# Altium schematic sheet 7-LTC2983.SchDoc: Thermocouple Temperature Logger
size A4; Date: 14.03.2026; Author: MG & JK; Revision: 1-0; SheetNumber: 7; SheetTotal: 7; Model: Rev 1.0; PageSetup: Record=PageOptions|CenterHorizontal=True|CenterVertical=True|PrintScale=0.52|XCorrection=1.00|YCorrection=1.00|PrintKind=1|BorderSize=5000000|LeftOffset=0|BottomOffset=0|Orientation=2|PaperLength=4200|PaperWidth=2970|Scale=100|PaperSource=7|PrintQuality=600|MediaType=1|DitherType=10|PaperKind=A3|PrintScaleMode=1
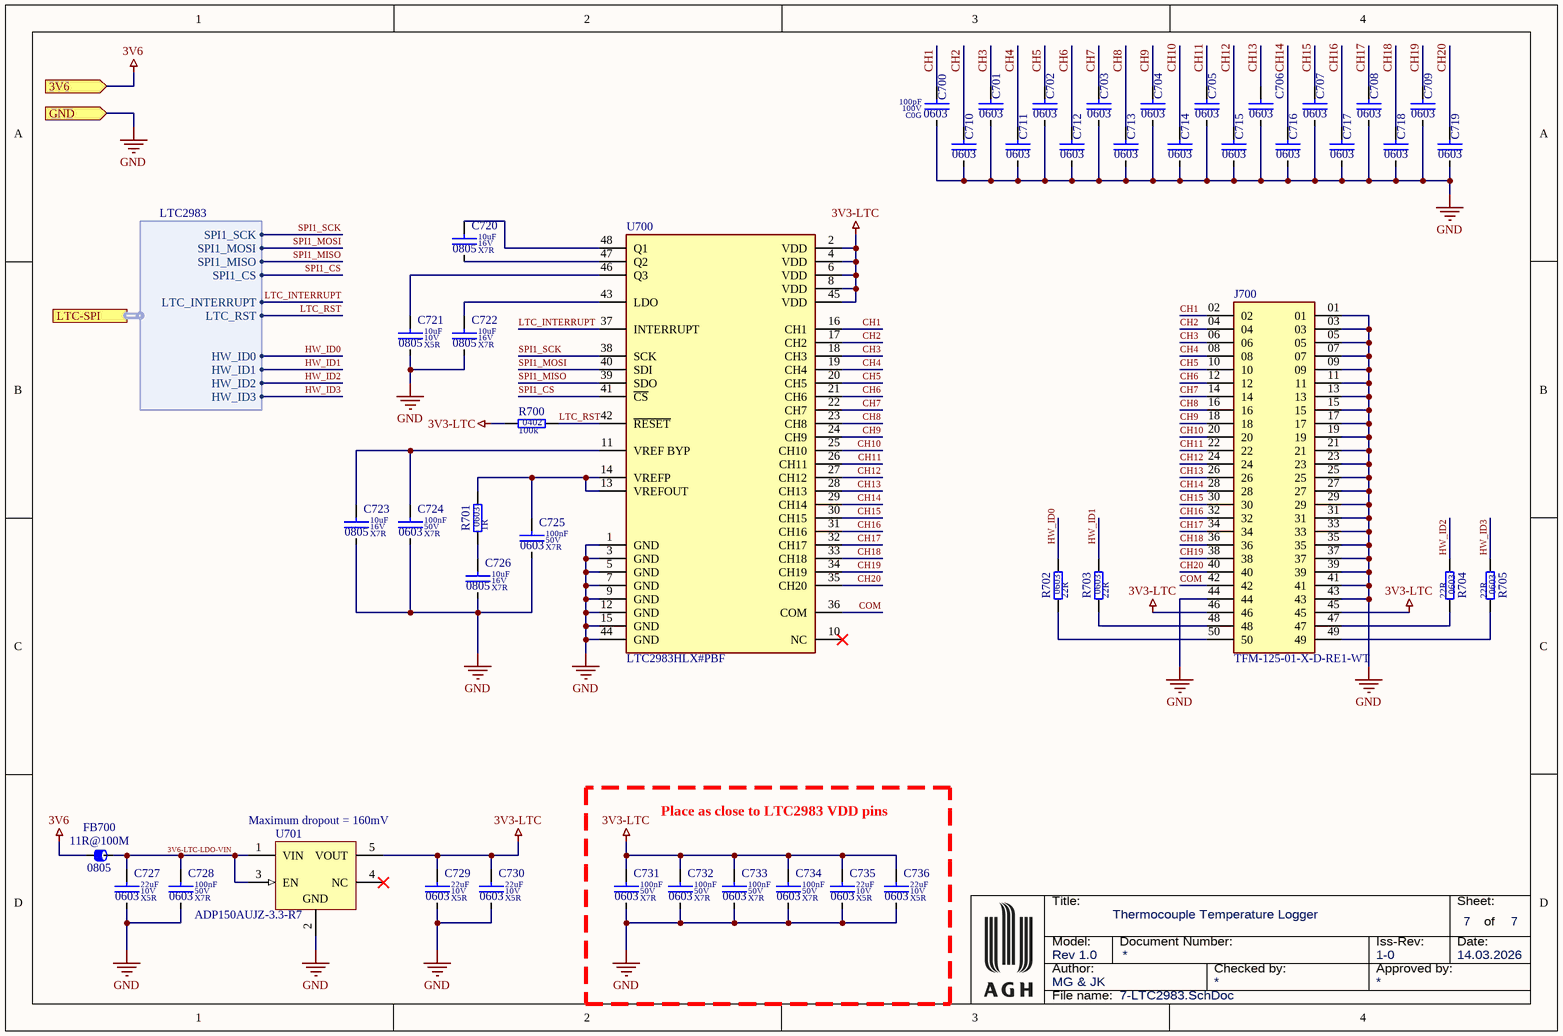
[diagram p0: 7-LTC2983.SchDoc]

## Parts
C700  value 100pF  Dielectric: C0G  Voltage: 100V  SCH_Footprint: 0603  [C_0603_1608]  (hidden comment: Ceramic C0G)
C701  SCH_Footprint: 0603  [C_0603_1608]  (hidden comment: Ceramic C0G)
C702  SCH_Footprint: 0603  [C_0603_1608]  (hidden comment: Ceramic C0G)
C703  SCH_Footprint: 0603  [C_0603_1608]  (hidden comment: Ceramic C0G)
C704  SCH_Footprint: 0603  [C_0603_1608]  (hidden comment: Ceramic C0G)
C705  SCH_Footprint: 0603  [C_0603_1608]  (hidden comment: Ceramic C0G)
C706  SCH_Footprint: 0603  [C_0603_1608]  (hidden comment: Ceramic C0G)
C707  SCH_Footprint: 0603  [C_0603_1608]  (hidden comment: Ceramic C0G)
C708  SCH_Footprint: 0603  [C_0603_1608]  (hidden comment: Ceramic C0G)
C709  SCH_Footprint: 0603  [C_0603_1608]  (hidden comment: Ceramic C0G)
C710  SCH_Footprint: 0603  [C_0603_1608]  (hidden comment: Ceramic C0G)
C711  SCH_Footprint: 0603  [C_0603_1608]  (hidden comment: Ceramic C0G)
C712  SCH_Footprint: 0603  [C_0603_1608]  (hidden comment: Ceramic C0G)
C713  SCH_Footprint: 0603  [C_0603_1608]  (hidden comment: Ceramic C0G)
C714  SCH_Footprint: 0603  [C_0603_1608]  (hidden comment: Ceramic C0G)
C715  SCH_Footprint: 0603  [C_0603_1608]  (hidden comment: Ceramic C0G)
C716  SCH_Footprint: 0603  [C_0603_1608]  (hidden comment: Ceramic C0G)
C717  SCH_Footprint: 0603  [C_0603_1608]  (hidden comment: Ceramic C0G)
C718  SCH_Footprint: 0603  [C_0603_1608]  (hidden comment: Ceramic C0G)
C719  SCH_Footprint: 0603  [C_0603_1608]  (hidden comment: Ceramic C0G)
C720  value 10uF  Dielectric: X7R  Voltage: 16V  SCH_Footprint: 0805  [C_0805_2012]  (hidden comment: Ceramic X7R)
C721  value 10uF  Dielectric: X5R  Voltage: 10V  SCH_Footprint: 0805  [C_0805_2012]  (hidden comment: Ceramic X5R)
C722  value 10uF  Dielectric: X7R  Voltage: 16V  SCH_Footprint: 0805  [C_0805_2012]  (hidden comment: Ceramic X7R)
C723  value 10uF  Dielectric: X7R  Voltage: 16V  SCH_Footprint: 0805  [C_0805_2012]  (hidden comment: Ceramic X7R)
C724  value 100nF  Dielectric: X7R  Voltage: 50V  SCH_Footprint: 0603  [C_0603_1608]  (hidden comment: Ceramic X7R)
C725  value 100nF  Dielectric: X7R  Voltage: 50V  SCH_Footprint: 0603  [C_0603_1608]  (hidden comment: Ceramic X7R)
C726  value 10uF  Dielectric: X7R  Voltage: 16V  SCH_Footprint: 0805  [C_0805_2012]  (hidden comment: Ceramic X7R)
C727  value 22uF  Dielectric: X5R  Voltage: 10V  SCH_Footprint: 0603  [C_0603_1608]  (hidden comment: Ceramic X5R)
C728  value 100nF  Dielectric: X7R  Voltage: 50V  SCH_Footprint: 0603  [C_0603_1608]  (hidden comment: Ceramic X7R)
C729  value 22uF  Dielectric: X5R  Voltage: 10V  SCH_Footprint: 0603  [C_0603_1608]  (hidden comment: Ceramic X5R)
C730  value 22uF  Dielectric: X5R  Voltage: 10V  SCH_Footprint: 0603  [C_0603_1608]  (hidden comment: Ceramic X5R)
C731  value 100nF  Dielectric: X7R  Voltage: 50V  SCH_Footprint: 0603  [C_0603_1608]  (hidden comment: Ceramic X7R)
C732  value 100nF  Dielectric: X7R  Voltage: 50V  SCH_Footprint: 0603  [C_0603_1608]  (hidden comment: Ceramic X7R)
C733  value 100nF  Dielectric: X7R  Voltage: 50V  SCH_Footprint: 0603  [C_0603_1608]  (hidden comment: Ceramic X7R)
C734  value 100nF  Dielectric: X7R  Voltage: 50V  SCH_Footprint: 0603  [C_0603_1608]  (hidden comment: Ceramic X7R)
C735  value 22uF  Dielectric: X5R  Voltage: 10V  SCH_Footprint: 0603  [C_0603_1608]  (hidden comment: Ceramic X5R)
C736  value 22uF  Dielectric: X5R  Voltage: 10V  SCH_Footprint: 0603  [C_0603_1608]  (hidden comment: Ceramic X5R)
FB700  value 11R@100M  SCH_Footprint: 0805  [FB_0805_2012]  (hidden comment: Ferrite bead)
J700  TFM-125-01-X-D-RE1-WT  [SAMTEC_TFM-125-01-X-D-RE1-WT]
R700  value 100k  SCH_Footprint: 0402  [R_0402_1005]  (hidden comment: Resistor)
R701  value 1R  SCH_Footprint: 0603  [R_0603_1608]  (hidden comment: Resistor)
R702  value 22R  SCH_Footprint: 0603  [R_0603_1608]  (hidden comment: Resistor)
R703  value 22R  SCH_Footprint: 0603  [R_0603_1608]  (hidden comment: Resistor)
R704  value 22R  SCH_Footprint: 0603  [R_0603_1608]  (hidden comment: Resistor)
R705  value 22R  SCH_Footprint: 0603  [R_0603_1608]  (hidden comment: Resistor)
U700  LTC2983HLX#PBF  [FP-LX-48-05-08-1760-MFG]
U701  ADP150AUJZ-3.3-R7  [ADI-UJ-5_M]

## Blocks framed on the sheet
Place as close to LTC2983 VDD pins: C731-C736

## Ports
3V6 (in, see 1-Block-diagram[4B], 3-Power-Supply[3B], 6-Connectors[1A]), GND (in, see 1-Block-diagram[4B], 2-STM32H563[2A], 3-Power-Supply[3A], 4-Ethernet[1A], 5-SD-Card[1A], 6-Connectors[1A]), LTC-SPI (harness LTC2983, see 1-Block-diagram[4B], 2-STM32H563[1C])

## Harnesses
LTC2983: SPI1_SCK, SPI1_MOSI, SPI1_MISO, SPI1_CS, HW_ID3, HW_ID2, HW_ID1, HW_ID0, LTC_INTERRUPT, LTC_RST

## Nets
3V3-LTC: C729.1 C730.1 C731.1 C732.1 C733.1 C734.1 C735.1 C736.1 J700.45 J700.46 R700.1 U700.2(VDD) U700.4(VDD) U700.6(VDD) U700.8(VDD) U700.45(VDD) U701.5(VOUT)
3V6: FB700.1 ; port 3V6
GND: C700.2 C701.2 C702.2 C703.2 C704.2 C705.2 C706.2 C707.2 C708.2 C709.2 C710.2 C711.2 C712.2 C713.2 C714.2 C715.2 C716.2 C717.2 C718.2 C719.2 C721.2 C722.2 C723.2 C724.2 C725.2 C726.2 C727.2 C728.2 C729.2 C730.2 C731.2 C732.2 C733.2 C734.2 C735.2 C736.2 J700.01 J700.03 J700.05 J700.07 J700.09 J700.11 J700.13 J700.15 J700.17 J700.19 J700.21 J700.23 J700.25 J700.27 J700.29 J700.31 J700.33 J700.35 J700.37 J700.39 J700.41 J700.43 J700.44 U700.1(GND) U700.3(GND) U700.5(GND) U700.7(GND) U700.9(GND) U700.12(GND) U700.15(GND) U700.44(GND) U701.2(GND) ; port GND
3V6-LTC-LDO-VIN: C727.1 C728.1 FB700.2 U701.1(VIN) U701.3(EN)
CH1: C700.1 J700.02 U700.16(CH1)
CH2: C710.1 J700.04 U700.17(CH2)
CH3: C701.1 J700.06 U700.18(CH3)
CH4: C711.1 J700.08 U700.19(CH4)
CH5: C702.1 J700.10 U700.20(CH5)
CH6: C712.1 J700.12 U700.21(CH6)
CH7: C703.1 J700.14 U700.22(CH7)
CH8: C713.1 J700.16 U700.23(CH8)
CH9: C704.1 J700.18 U700.24(CH9)
CH10: C714.1 J700.20 U700.25(CH10)
CH11: C705.1 J700.22 U700.26(CH11)
CH12: C715.1 J700.24 U700.27(CH12)
CH13: C706.1 J700.26 U700.28(CH13)
CH14: C716.1 J700.28 U700.29(CH14)
CH15: C707.1 J700.30 U700.30(CH15)
CH16: C717.1 J700.32 U700.31(CH16)
CH17: C708.1 J700.34 U700.32(CH17)
CH18: C718.1 J700.36 U700.33(CH18)
CH19: C709.1 J700.38 U700.34(CH19)
CH20: C719.1 J700.40 U700.35(CH20)
COM: J700.42 U700.36(COM)
HW_ID0: R702.2 ; port LTC-SPI.HW_ID0
HW_ID1: R703.2 ; port LTC-SPI.HW_ID1
HW_ID2: R704.2 ; port LTC-SPI.HW_ID2
HW_ID3: R705.2 ; port LTC-SPI.HW_ID3
LTC_INTERRUPT: U700.37(INTERRUPT) ; port LTC-SPI.LTC_INTERRUPT
LTC_RST: R700.2 U700.42(~{RESET}) ; port LTC-SPI.LTC_RST
SPI1_CS: U700.41(~{CS}) ; port LTC-SPI.SPI1_CS
SPI1_MISO: U700.39(SDO) ; port LTC-SPI.SPI1_MISO
SPI1_MOSI: U700.40(SDI) ; port LTC-SPI.SPI1_MOSI
SPI1_SCK: U700.38(SCK) ; port LTC-SPI.SPI1_SCK
NetC720_1: C720.1 U700.48(Q1)
NetC720_2: C720.2 U700.47(Q2)
NetC721_1: C721.1 U700.46(Q3)
NetC722_1: C722.1 U700.43(LDO)
NetC723_1: C723.1 C724.1 U700.11(VREF_BYP)
NetC725_1: C725.1 R701.2 U700.13(VREFOUT) U700.14(VREFP)
NetC726_1: C726.1 R701.1
NetJ700_47: J700.47 R704.1
NetJ700_48: J700.48 R703.1
NetJ700_49: J700.49 R705.1
NetJ700_50: J700.50 R702.1

Not connected (* = marked no-connect by the designer): U700 10(NC)*; U701 4(NC)*

## Notes on the sheet
- (near U701) Maximum dropout = 160mV
- Title:
- Sheet:
- of
- Author:
- Model:
- Document Number:
- Checked by:
- Iss-Rev:
- Approved by:
- Date:
- File name:

## Library data of the parts
C700 = C_100pF_100V_C0G_0603_5_AECQ1: Capacitor; Manufacturer: Murata; Manufacturer Part Number: GCM1885C2A101JA16D; Tolerance (%): 5; AEC-Q: 1; Part Number: C_100pF_100V_C0G_0603_5_AECQ1; HelpURL: https://www.murata.com/products/productdetail?partno=GCM1885C2A101JA16%23; Supplier 1: TME; Supplier Part Number 1: GCM1885C2A101JA16D; Supplier 2: RS Components; Supplier 3: Farnell; Supplier Part Number 3: 2688624; Supplier 4: Mouser; Supplier Part Number 4: 81-GCM1885C2A101JA6D; Supplier 5: Digi-Key; Supplier Part Number 5: 490-4771-1-ND; Supplier 6: LCSC; Supplier Part Number 6: C126576
C701-C719 = C_100pF_100V_C0G_0603_5_AECQ1: Capacitor; Manufacturer: Murata; Manufacturer Part Number: GCM1885C2A101JA16D; Voltage: 100V; Value: 100pF; Tolerance (%): 5; AEC-Q: 1; Dielectric: C0G; Part Number: C_100pF_100V_C0G_0603_5_AECQ1; HelpURL: https://www.murata.com/products/productdetail?partno=GCM1885C2A101JA16%23; Supplier 1: TME; Supplier Part Number 1: GCM1885C2A101JA16D; Supplier 2: RS Components; Supplier 3: Farnell; Supplier Part Number 3: 2688624; Supplier 4: Mouser; Supplier Part Number 4: 81-GCM1885C2A101JA6D; Supplier 5: Digi-Key; Supplier Part Number 5: 490-4771-1-ND; Supplier 6: LCSC; Supplier Part Number 6: C126576
C720 C722 C723 C726 = C_10uF_16V_X7R_0805_10: Capacitor; Manufacturer: Taiyo Yuden; Manufacturer Part Number: EMK212BB7106KG-T; Tolerance (%): 10; Part Number: C_10uF_16V_X7R_0805_10; HelpURL: https://www.mouser.pl/datasheet/2/396/mlcc02_e-1307760.pdf; Supplier 1: TME; Supplier 2: RS Components; Supplier 3: Farnell; Supplier 4: Mouser; Supplier Part Number 4: 963-EMK212BB7106KG-T; Supplier 5: Digi-Key; Supplier Part Number 5: 587-6139-1-ND; Supplier 6: LCSC
C721 = C_10uF_10V_X5R_0805_10: Capacitor; Manufacturer: Kemet; Manufacturer Part Number: C0805C106K8PACTU; Tolerance (%): 10; Part Number: C_10uF_10V_X5R_0805_10; HelpURL: https://www.mouser.pl/datasheet/2/447/KEM_C1006_X5R_SMD-3316465.pdf; Supplier 1: TME; Supplier Part Number 1: C0805C106K8PAC; Supplier 2: RS Components; Supplier Part Number 2: 8029850; Supplier 3: Farnell; Supplier Part Number 3: 1463362; Supplier 4: Mouser; Supplier Part Number 4: 80-C0805C106K8P; Supplier 5: Digi-Key; Supplier Part Number 5: 399-C0805C106K8PAC7800CT-ND; Supplier 6: LCSC
C724 C725 C728 C731-C734 = C_100nF_50V_X7R_0603_10_AECQ1: Capacitor; Manufacturer: Murata; Manufacturer Part Number: GCM188R71H104KA57D; Tolerance (%): 10; AEC-Q: 1; Part Number: C_100nF_50V_X7R_0603_10_AECQ1; HelpURL: https://www.murata.com/products/productdetail?partno=GCM188R71H104KA57%23; Supplier 1: TME; Supplier Part Number 1: GCM188R71H104KA57D; Supplier 2: RS Components; Supplier 3: Farnell; Supplier Part Number 3: 4360223; Supplier 4: Mouser; Supplier Part Number 4: 81-GCM188R71H104KA7D; Supplier 5: Digi-Key; Supplier Part Number 5: 490-4779-1-ND; Supplier 6: LCSC; Supplier Part Number 6: C85864
C727 C729 C730 C735 C736 = C_22uF_10V_X5R_0603_20: Capacitor; Manufacturer: Murata; Manufacturer Part Number: GRM188R61A226ME15D; Tolerance (%): 20; Part Number: C_22uF_10V_X5R_0603_20; HelpURL: https://www.mouser.pl/datasheet/2/281/1/GRM188R61A226ME15_02A-1985787.pdf; Supplier 1: TME; Supplier Part Number 1: GRM188R61A226ME15D; Supplier 2: RS Components; Supplier 3: Farnell; Supplier Part Number 3: 2426957; Supplier 4: Mouser; Supplier Part Number 4: 81-GRM188R61A226ME5D; Supplier 5: Digi-Key; Supplier Part Number 5: 490-10476-1-ND; Supplier 6: LCSC
FB700 = FB_2508051107Y0: Manufacturer: Fair-Rite; Current: 300mA; Resistance: 100mR; Part Number: FB_2508051107Y0; HelpURL: https://datasheet.octopart.com/2508051107Y0-Fair-Rite-datasheet-834.pdf; Manufacturer Part Number: 2508051107Y0; Supplier 1: TME; Supplier 2: RS Components; Supplier 3: Farnell; Supplier Part Number 3: 1612004; Supplier 4: Mouser; Supplier Part Number 4: 623-2508051107Y0; Supplier 5: Digi-Key; Supplier Part Number 5: 1934-1397-1-ND; Supplier 6: LCSC
J700 = TFM-125-01-X-D-RE1-WT: MF: Samtec; Package: None; Price: None; Value: *; MP: TFM-125-01-X-D-RE1-WT; Availability: Unavailable
R700 = R_100k_0402_1: Manufacturer: Yageo; Manufacturer Part Number: RC0402FR-07100KL; Voltage: 50V; Power: 63mW; Tolerance: 1%; Part Number: R_100k_0402_1; HelpURL: http://www.tme.eu/pl/Document/1a2bc76e2be68b3b1670068306778ce6/rc0402yageo.pdf; Supplier 1: TME; Supplier Part Number 1: RC0402FR-07100K; Supplier 2: RS Components; Supplier 3: Farnell; Supplier Part Number 3: 2131798; Supplier 4: Mouser; Supplier Part Number 4: 603-RC0402FR-07100KL; Supplier 5: Digi-Key; Supplier Part Number 5: 311-100KLRCT-ND; Supplier 6: LCSC
R701 = R_1R_0603_1: Manufacturer: Yageo; Manufacturer Part Number: RC0603FR-071RL; Voltage: 50V; Power: 100mW; Tolerance: 1%; Part Number: R_1R_0603_1; HelpURL: http://www.tme.eu/en/Document/9fef8ccbb584e9f6a1c931cf356afd5c/PYu-RC0603_51_RoHS_L_4.pdf; Supplier 1: TME; Supplier Part Number 1: RC0603FR-071R; Supplier 2: RS Components; Supplier 3: Farnell; Supplier Part Number 3: 9238123; Supplier 4: Mouser; Supplier Part Number 4: 603-RC0603FR-071RL; Supplier 5: Digi-Key; Supplier Part Number 5: 311-1.00HRCT-ND; Supplier 6: LCSC
R702-R705 = R_22R_0603_5: Manufacturer: Walsin; Manufacturer Part Number: WF06P220JTL; Voltage: 50V; Power: 125mW; Tolerance: 5%; Part Number: R_22R_0603_5; HelpURL: http://www.tme.eu/pl/Document/b315665a56acbc42df513c99b390ad98/ROYALOHM-THICKFILM.pdf; Supplier 1: TME; Supplier Part Number 1: WF06P-22R-5%; Supplier 2: RS Components; Supplier 3: Farnell; Supplier 4: Mouser; Supplier 5: Digi-Key; Supplier 6: LCSC
U700 = CMP-09104-000007-1: MULTI SENSOR HIGH ACCURACY DIGIT; Min Supply Voltage: 2.85V; Max Supply Voltage: 5.25V; Output Type: SPI; Number of Pins: 48; REACH SVHC: No SVHC; Mount: Surface Mount; Case/Package: LQFP; Max Operating Temperature: 125°C; RoHS Compliant: Yes; Series: -; Min Operating Temperature: -40°C; Packaging: Tray
U701 = CMP-0786-00394-1: Ultralow Noise, 150 mA CMOS Linear Regulator, 2.2 to 5.5 V Vin, 3.3 V Vout, Industrial, 5-pin SOT23 (UJ-5), Reel; Manufacturer: Analog Devices; Supply Current IGND @ Small Load: 10uA; Vin (min) (V): 2.2; Iout max: 150mA; Preset Vout Values (V): 3.3; Vin (max) (V): 5.5; ComponentLink2Description: Datasheet; PackageReference: UJ-5; DatasheetVersion: Rev. A; PackageDescription: 5-Pin Thin Small Outline Transistor Package, Body 2.9 x 1.6 mm, Pitch 0.95 mm; ComponentLink4URL: Product URL:http://www.analog.com/en/ADP150/productSearch.html; Packing: Reel; ComponentLink1URL: http://www.analog.com/en/index.html; PartNumber: ADP150AUJZ-3.3-R7; PackageVersion: 100708-A, 10/2008; ComponentLink3Description: Package Specification; ComponentLink3URL: http:/www.analog.com/static/imported-files/packages/PKG_PDF/TSOT(UJ)/UJ_5.pdf; ComponentLink4Description: URL Link1; ComponentLink2URL: http://www.analog.com/static/imported-files/data_sheets/ADP150.pdf; Code_JEDEC: MO-193-AB; Mounting Technology: Surface Mount; ComponentLink1Description: Manufacturer URL